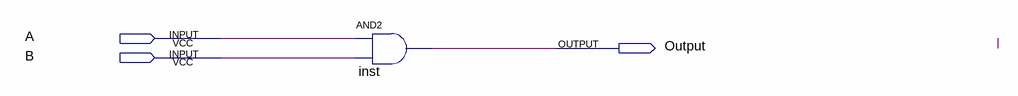
[diagram p0: schematic sheet]
// Quartus schematic 2pin-logic-and-test.bdf as structural Verilog: 1 symbols, 3 pins
module \2pin-logic-and-test  (
  input  A,
  input  B,
  output Output
);

  and inst (Output, A, B);
endmodule
